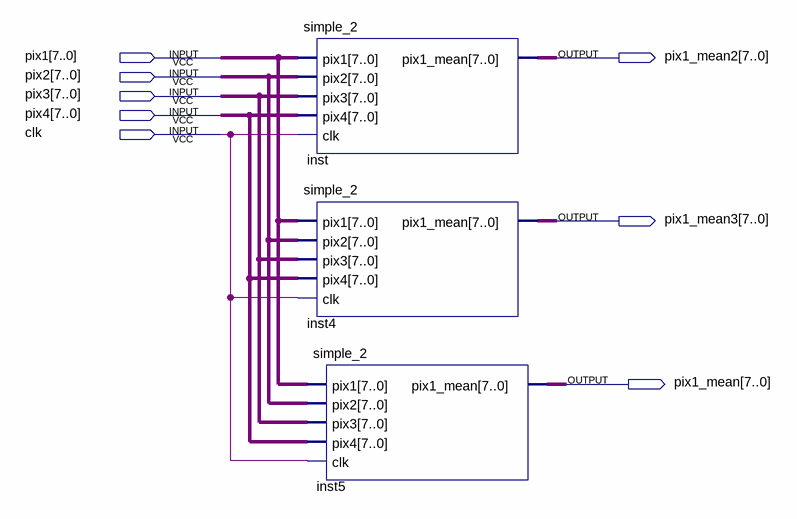
[diagram p0: schematic sheet]
// Quartus schematic simple_4.bdf as structural Verilog: 3 symbols, 8 pins
module simple_4 (
  input  [7:0] pix1,
  input  [7:0] pix2,
  input  [7:0] pix3,
  input  [7:0] pix4,
  input  clk,
  output [7:0] pix1_mean2,
  output [7:0] pix1_mean3,
  output [7:0] pix1_mean
);

  simple_2 inst (.pix1(pix1), .pix2(pix2), .pix3(pix3), .pix4(pix4), .clk(clk), .pix1_mean(pix1_mean2));
  simple_2 inst4 (.pix1(pix1), .pix2(pix2), .pix3(pix3), .pix4(pix4), .clk(clk), .pix1_mean(pix1_mean3));
  simple_2 inst5 (.pix1(pix1), .pix2(pix2), .pix3(pix3), .pix4(pix4), .clk(clk), .pix1_mean(pix1_mean));
endmodule
